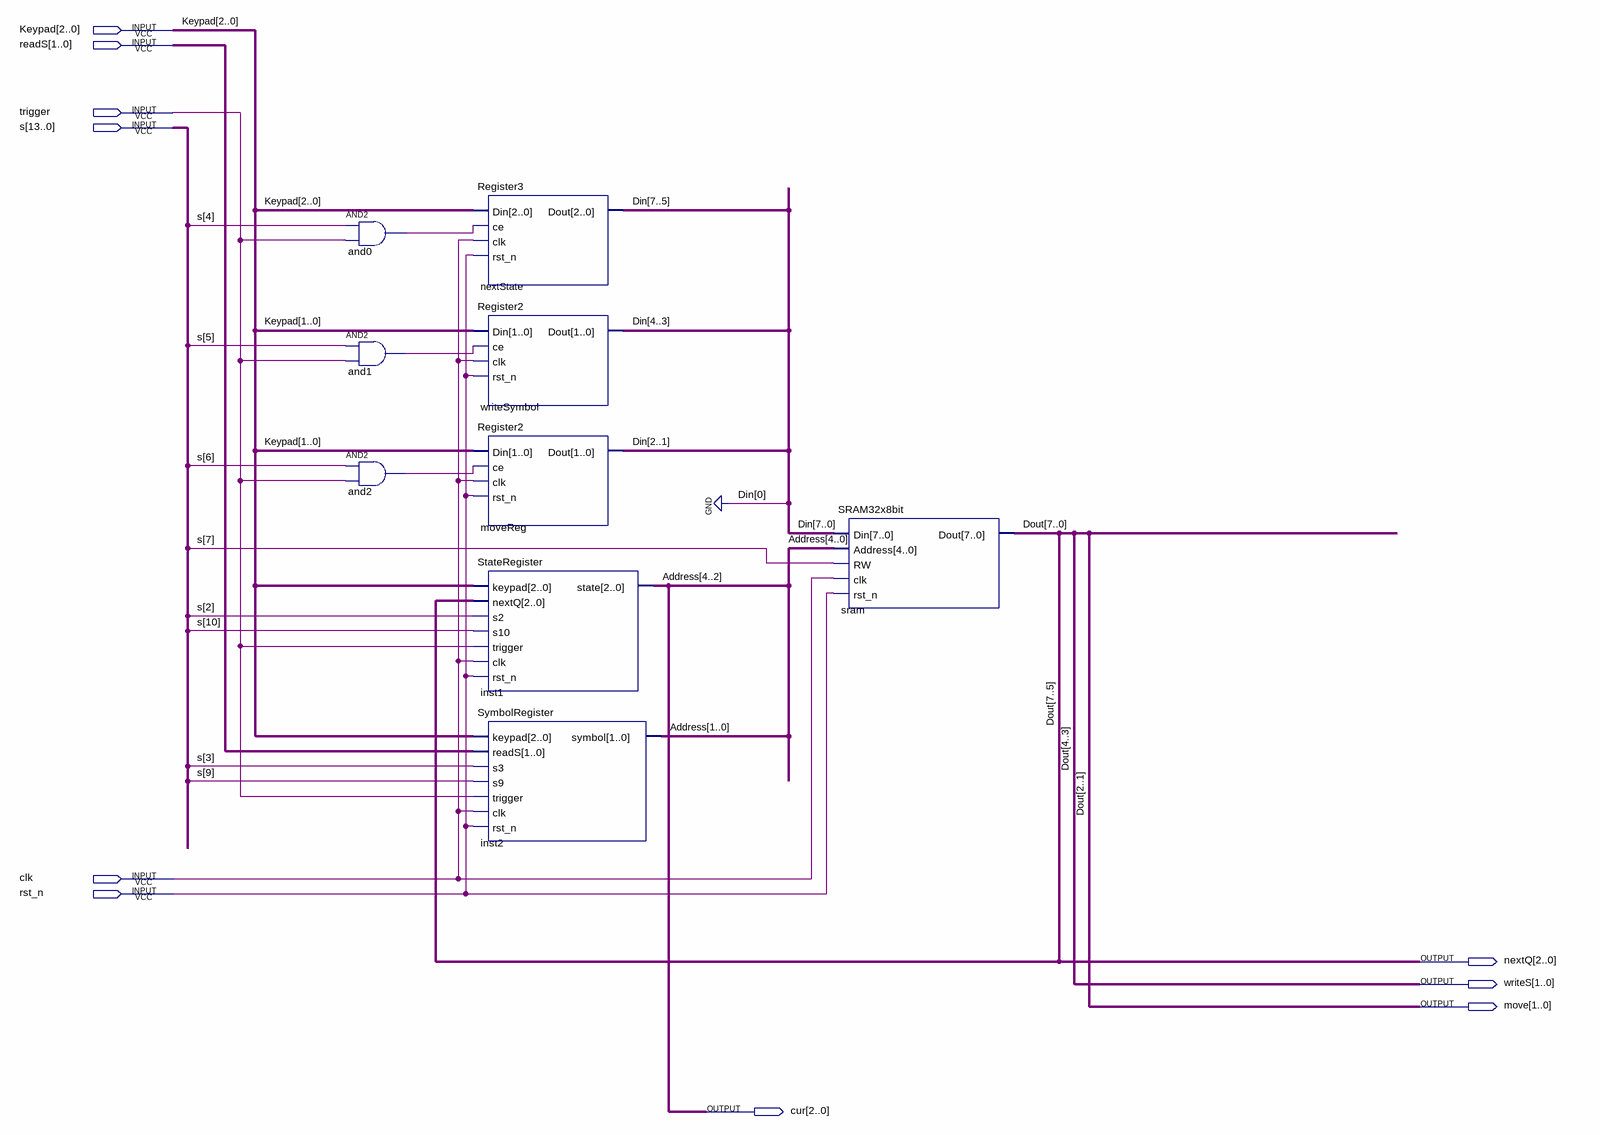
[diagram p0: schematic sheet]
// Quartus schematic TableRegister.bdf as structural Verilog: 9 symbols, 10 pins
module TableRegister (
  input  [2:0] Keypad,
  input  [1:0] readS,
  input  trigger,
  input  [13:0] s,
  input  clk,
  input  rst_n,
  output [2:0] nextQ,
  output [1:0] writeS,
  output [1:0] move,
  output [2:0] cur
);

  wire and0_out, and1_out, and2_out;
  wire [0:0] Dout;
  wire [1:0] Address;
  wire [7:1] Din;

  and and0 (and0_out, s[4], trigger);
  and and1 (and1_out, s[5], trigger);
  and and2 (and2_out, s[6], trigger);
  Register3 nextState (.Din(Keypad), .ce(and0_out), .clk(clk), .rst_n(rst_n), .Dout(Din[7:5]));
  Register2 writeSymbol (.Din(Keypad[1:0]), .ce(and1_out), .clk(clk), .rst_n(rst_n), .Dout(Din[4:3]));
  Register2 moveReg (.Din(Keypad[1:0]), .ce(and2_out), .clk(clk), .rst_n(rst_n), .Dout(Din[2:1]));
  StateRegister inst1 (
    .keypad(Keypad), .nextQ(nextQ), .s2(s[2]), .s10(s[10]), .trigger(trigger), .clk(clk), .rst_n(rst_n),
    .state(cur));
  SymbolRegister inst2 (
    .keypad(Keypad), .readS(readS), .s3(s[3]), .s9(s[9]), .trigger(trigger), .clk(clk), .rst_n(rst_n),
    .symbol(Address));
  SRAM32x8bit sram (
    .Din({Din, 1'b0}), .Address({cur, Address}), .RW(s[7]), .clk(clk), .rst_n(rst_n),
    .Dout({nextQ, writeS, move, Dout[0]}));

  // Other names for the same wires on the sheet: Address[4:2] = cur; Dout[7:1] = {nextQ, writeS, move}
endmodule
